# EAGLE design TD3_Filter_dsPIC33EP128GP502 (EAGLE 6.4)
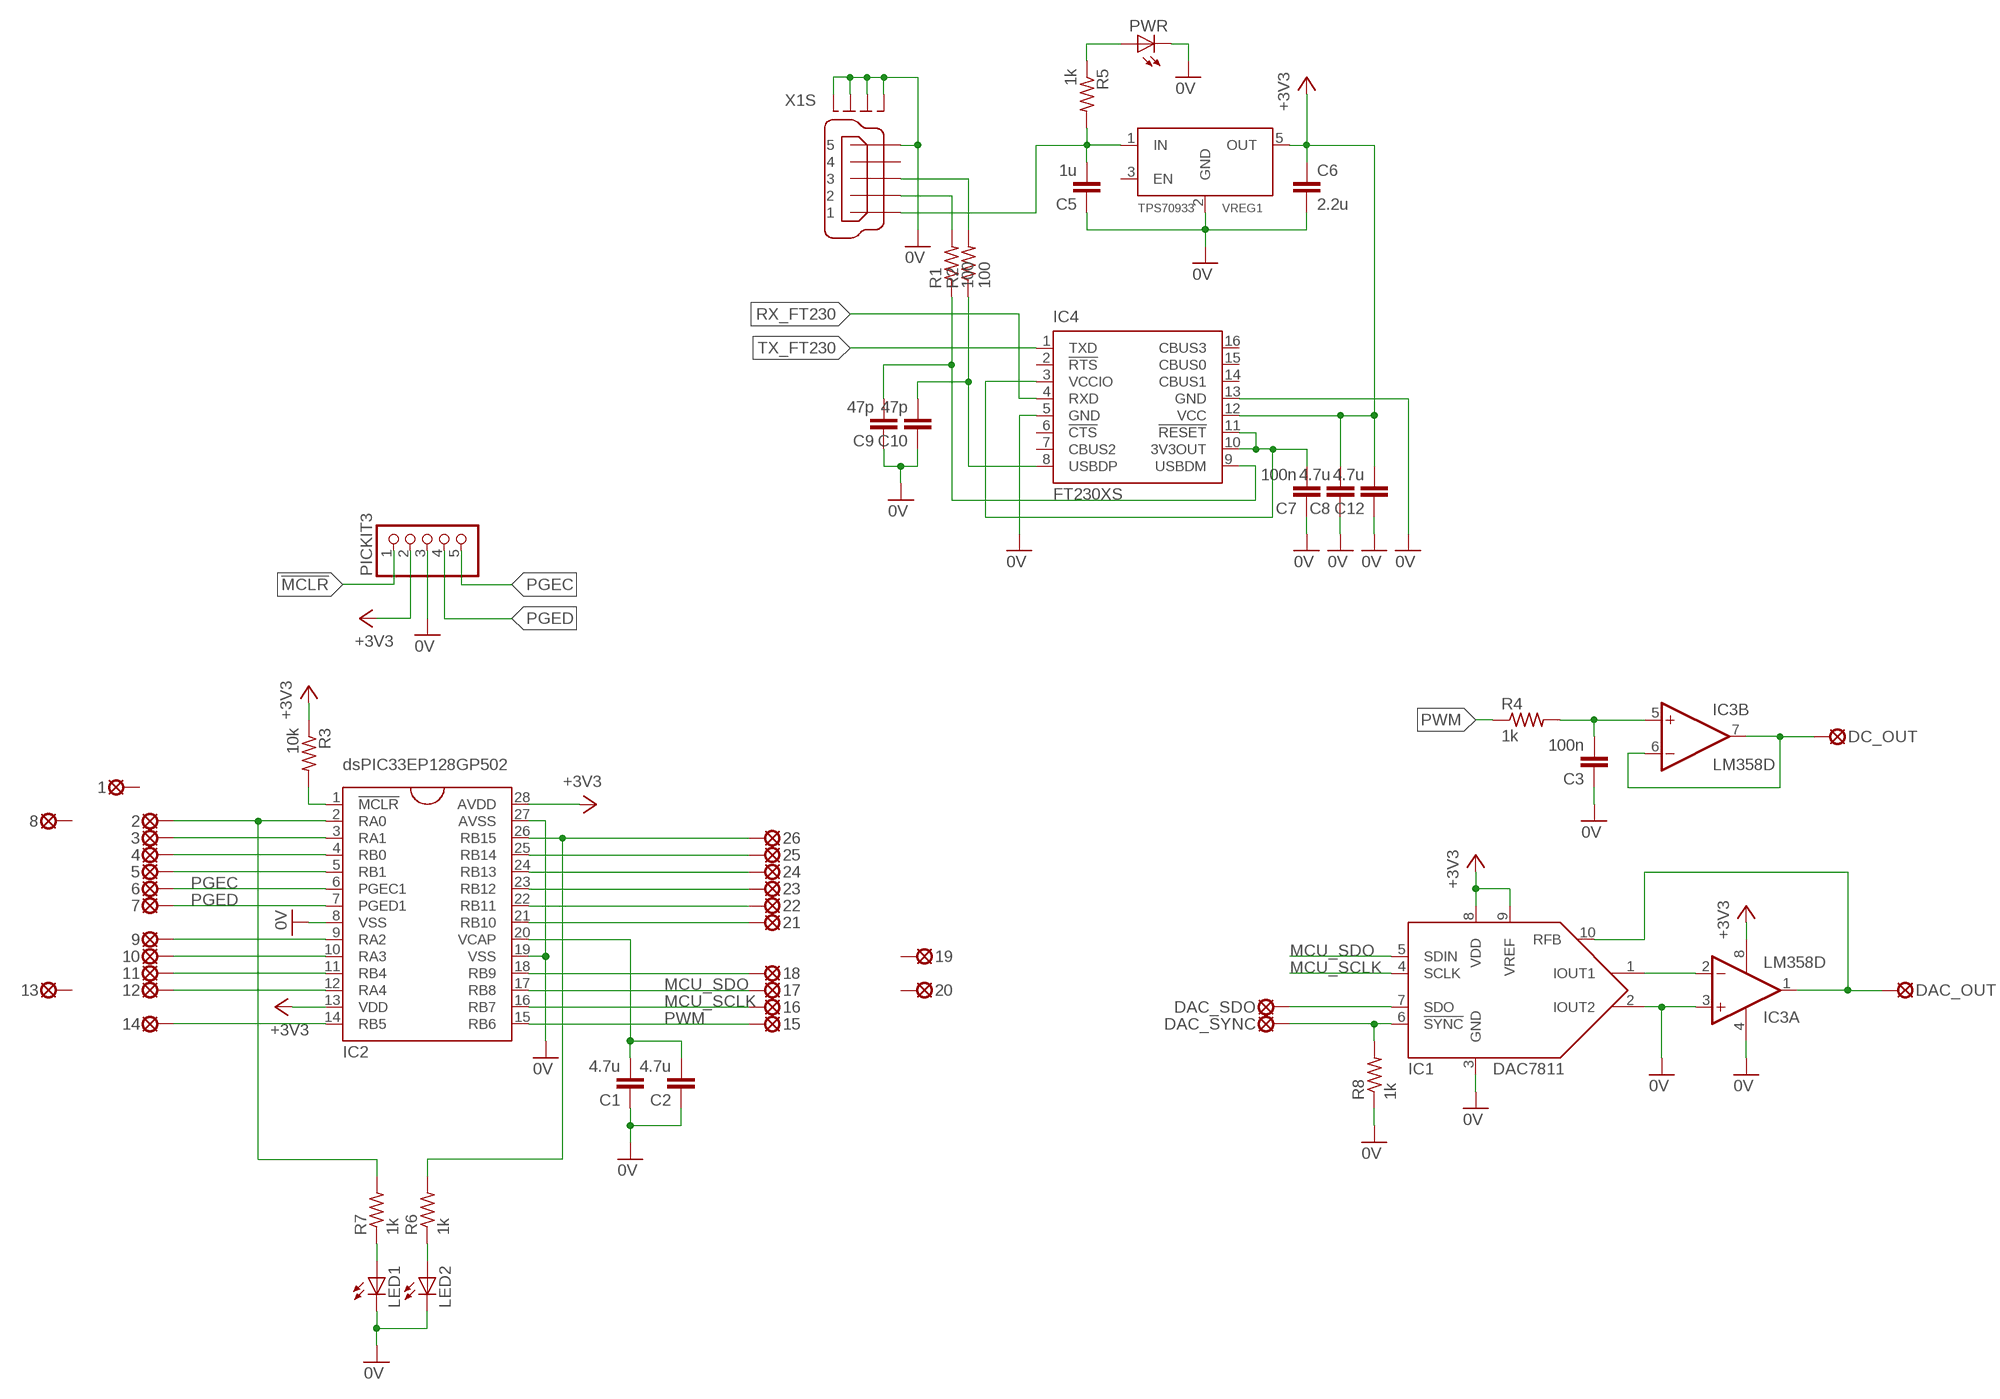
[diagram p0: schematic, sheet 1]

## Parts
1  LSP10  [LSP10]
2  LSP10  [LSP10]
3  LSP10  [LSP10]
4  LSP10  [LSP10]
5  LSP10  [LSP10]
6  LSP10  [LSP10]
7  LSP10  [LSP10]
8  LSP10  [LSP10]
9  LSP10  [LSP10]
10  LSP10  [LSP10]
11  LSP10  [LSP10]
12  LSP10  [LSP10]
13  LSP10  [LSP10]
14  LSP10  [LSP10]
15  LSP10  [LSP10]
16  LSP10  [LSP10]
17  LSP10  [LSP10]
18  LSP10  [LSP10]
19  LSP10  [LSP10]
20  LSP10  [LSP10]
21  LSP10  [LSP10]
22  LSP10  [LSP10]
23  LSP10  [LSP10]
24  LSP10  [LSP10]
25  LSP10  [LSP10]
26  LSP10  [LSP10]
C1  4.7u  C-EUC1206  [C1206]
C2  4.7u  C-EUC1206  [C1206]
C3  100n  C-EUC1206  [C1206]
C5  1u  C-EUC1206  [C1206]
C6  2.2u  C-EUC1206  [C1206]
C7  100n  C-EUC1206  [C1206]
C8  4.7u  C-EUC1206  [C1206]
C9  47p  C-EUC1206  [C1206]
C10  47p  C-EUC1206  [C1206]
C12  4.7u  C-EUC1206  [C1206]
DAC_OUT  LSP10  [LSP10]
DAC_SDO  LSP10  [LSP10]
DAC_SYNC  LSP10  [LSP10]
DC_OUT  LSP10  [LSP10]
IC1  DAC7811  [S-PDSO-G10]
IC2  DSPIC33EP128GP502  [DIL28]
IC3  LM358D  [SO08]
IC4  FT230XS  [SSOP16]
LED1  LED3MM  [LED3MM]
LED2  LED3MM  [LED3MM]
PICKIT3  PINHD-1X5  [1X05]
PWR  LED3MM  [LED3MM]
R1  100  R-US_R0805  [R0805]
R2  100  R-US_R1206  [R1206]
R3  10k  R-US_R0805  [R0805]
R4  1k  R-US_R0805  [R0805]
R5  1k  R-US_R0805  [R0805]
R6  1k  R-US_R0805  [R0805]
R7  1k  R-US_R0805  [R0805]
R8  1k  R-US_R0805  [R0805]
VREG1  TPS70933  [TPS70933]
X1  MINI-USB_SHIELD5P4-32005-400  [32005-400]

## Nets
0V: C1.1 C2.1 C3.1 C5.1 C6.2 C7.1 C8.1 C9.1 C10.1 C12.1 IC1.2(IOUT2) IC1.3(GND) IC2.8(VSS) IC2.19(VSS) IC2.27(AVSS) IC3.3(A:+IN) IC3.4(P:V-) IC4.5(GND) IC4.13(GND) LED1.K(C) LED2.K(C) PICKIT3.3 PWR.K(C) R8.1 VREG1.2(GND) X1.5 X1.M1(S1) X1.M2(S2) X1.M3(S3) X1.M4(S4)
!MCLR!: PICKIT3.1
+3V3: C6.1 C8.2 C12.2 IC1.8(VDD) IC1.9(VREF) IC2.13(VDD) IC2.28(AVDD) IC3.8(P:V+) IC4.12(VCC) PICKIT3.2 R3.1 VREG1.5(OUT)
MCU_SCLK: 16.MP IC1.4(SCLK) IC2.16(RB7)
MCU_SDO: 17.MP IC1.5(SDIN) IC2.17(RB8)
N$1: IC1.1(IOUT1) IC3.2(A:-IN)
N$2: C3.2 IC3.5(B:+IN) R4.2
N$3: PWR.A R5.1
N$4: IC2.1(!MCLR!) R3.2
N$5: DAC_SYNC.MP IC1.6(!SYNC!) R8.2
N$6: C7.2 IC4.3(VCCIO) IC4.10(3V3OUT) IC4.11(!RESET)
N$7: R2.2 X1.3
N$8: C1.2 C2.2 IC2.20(VCAP)
N$9: DAC_SDO.MP IC1.7(SDO)
N$10: C10.2 IC4.8(USBDP) R2.1
N$11: R1.2 X1.2
N$12: C9.2 IC4.9(USBDM) R1.1
N$13: DAC_OUT.MP IC1.10(RFB) IC3.1(A:OUT)
N$15: DC_OUT.MP IC3.6(B:-IN) IC3.7(B:OUT)
N$16: 3.MP IC2.3(RA1)
N$17: 4.MP IC2.4(RB0)
N$18: 5.MP IC2.5(RB1)
N$19: 9.MP IC2.9(RA2)
N$20: 10.MP IC2.10(RA3)
N$21: 11.MP IC2.11(RB4)
N$22: 12.MP IC2.12(RA4)
N$23: 14.MP IC2.14(RB5)
N$24: 22.MP IC2.22(RB11)
N$25: 18.MP IC2.18(RB9)
N$26: 21.MP IC2.21(RB10)
N$27: 23.MP IC2.23(RB12)
N$28: 24.MP IC2.24(RB13)
N$29: 25.MP IC2.25(RB14)
N$31: LED2.A R6.1
N$32: LED1.A R7.1
N$33: 2.MP IC2.2(RA0) R7.2
N$34: C5.2 R5.2 VREG1.1(IN) X1.1
N$35: 26.MP IC2.26(RB15) R6.2
PGEC: 6.MP IC2.6(PGEC1) PICKIT3.5
PGED: 7.MP IC2.7(PGED1) PICKIT3.4
PWM: 15.MP IC2.15(RB6) R4.1
RX_FT230: IC4.4(RXD)
TX_FT230: IC4.1(TXD)
Unconnected: 1.MP 8.MP 13.MP 19.MP 20.MP IC4.2(!RTS) IC4.6(!CTS) IC4.7(CBUS2) IC4.14(CBUS1) IC4.15(CBUS0) IC4.16(CBUS3) VREG1.3(EN) X1.4

## Library data of the parts
1-26 DAC_OUT DAC_SDO DAC_SYNC DC_OUT = solpad:LSP10: SOLDER PAD drill 1.0 mm, distributor Buerklin, 12H555
C1-C3 C5-C10 C12 = rcl:C-EU: CAPACITOR, European symbol
IC1 = DAC7811:DAC7811
IC2 = DSPIC33EP128GP502:DSPIC33EP128GP502
IC3 = linear:LM358: OP AMP also LM158; LM258; LM2904 Source: http://cache.national.com/ds/LM/LM158.pdf
IC4 = ftdichip:FT230X: USB to BASIC UART IC Auto generated by make-symbol-device-package-bsdl.ulp Rev. 43 Source: Data sheet <http://www.ftdichip.com/Support/Documents/DataSheets/ICs/DS_FT230X.pdf>
LED1 LED2 PWR = led:LED: LED OSRAM: - CHIPLED LG R971, LG N971, LY N971, LG Q971, LY Q971, LO R971, LY R971 LH N974, LH R974 LS Q976, LO Q976, LY Q976 LO Q996 - Hyper CHIPLED LW Q18S LB Q993, LB Q99A, LB R99A - SideLED LS A670, LO A670, LY A670, LG A670, LP A670 LB A673, LV A673, LT A673, LW A673 LH A674 LY A675 LS A676, LA A676, LO A676, LY A676, LW A676 LS A679, LY A679, LG A679 - Hyper Micro SIDELED® LS Y876, LA Y876, LO Y876, LY Y876 LT Y87S - SmartLED LW L88C, LW L88S LB L89C, LB L89S, LG L890 LS L89K, LO L89K, LY L89K LS L896, LA L896, LO L896, LY L896 - TOPLED LS T670, LO T670, LY T670, LG T670, LP T670 LSG T670, LSP T670, LSY T670, LOP T670, LYG T670 LG T671, LOG T671, LSG T671 LB T673, LV T673, LT T673, LW T673 LH T674 LS T676, LA T676, LO T676, LY T676, LB T676, LH T676, LSB T676, LW T676 LB T67C, LV T67C, LT T67C, LS T67K, LO T67K, LY T67K, LW E67C LS E67B, LA E67B, LO E67B, LY E67B, LB E67C, LV E67C, LT E67C LW T67C LS T679, LY T679, LG T679 LS T770, LO T770, LY T770, LG T770, LP T770 LB T773, LV T773, LT T773, LW T773 LH T774 LS E675, LA E675, LY E675, LS T675 LS T776, LA T776, LO T776, LY T776, LB T776 LHGB T686 LT T68C, LB T68C - Hyper Mini TOPLED® LB M676 - Mini TOPLED Santana® LG M470 LS M47K, LO M47K, LY M47K Source: http://www.osram.convergy.de LUXEON: - LUMILED® LXK2-PW12-R00, LXK2-PW12-S00, LXK2-PW14-U00, LXK2-PW14-V00 LXK2-PM12-R00, LXK2-PM12-S00, LXK2-PM14-U00 LXK2-PE12-Q00, LXK2-PE12-R00, LXK2-PE12-S00, LXK2-PE14-T00, LXK2-PE14-U00 LXK2-PB12-K00, LXK2-PB12-L00, LXK2-PB12-M00, LXK2-PB14-N00, LXK2-PB14-P00, LXK2-PB14-Q00 LXK2-PR12-L00, LXK2-PR12-M00, LXK2-PR14-Q00, LXK2-PR14-R00 LXK2-PD12-Q00, LXK2-PD12-R00, LXK2-PD12-S00 LXK2-PH12-R00, LXK2-PH12-S00 LXK2-PL12-P00, LXK2-PL12-Q00, LXK2-PL12-R00 Source: www.luxeon.com KINGBRIGHT: KA-3528ASYC Source: www.kingbright.com
PICKIT3 = pinhead:PINHD-1X5: PIN HEADER
R1-R8 = rcl:R-US_: RESISTOR, American symbol
VREG1 = TPS70933:TPS70933
X1 = con-cypressindustries:MINI-USB_SHIELD5P4-: MINI USB-B R/A W/O POST 5 pol. Source: www.cypressindustries.com; OC_FARNELL: unknown; OC_NEWARK: unknown

## Board
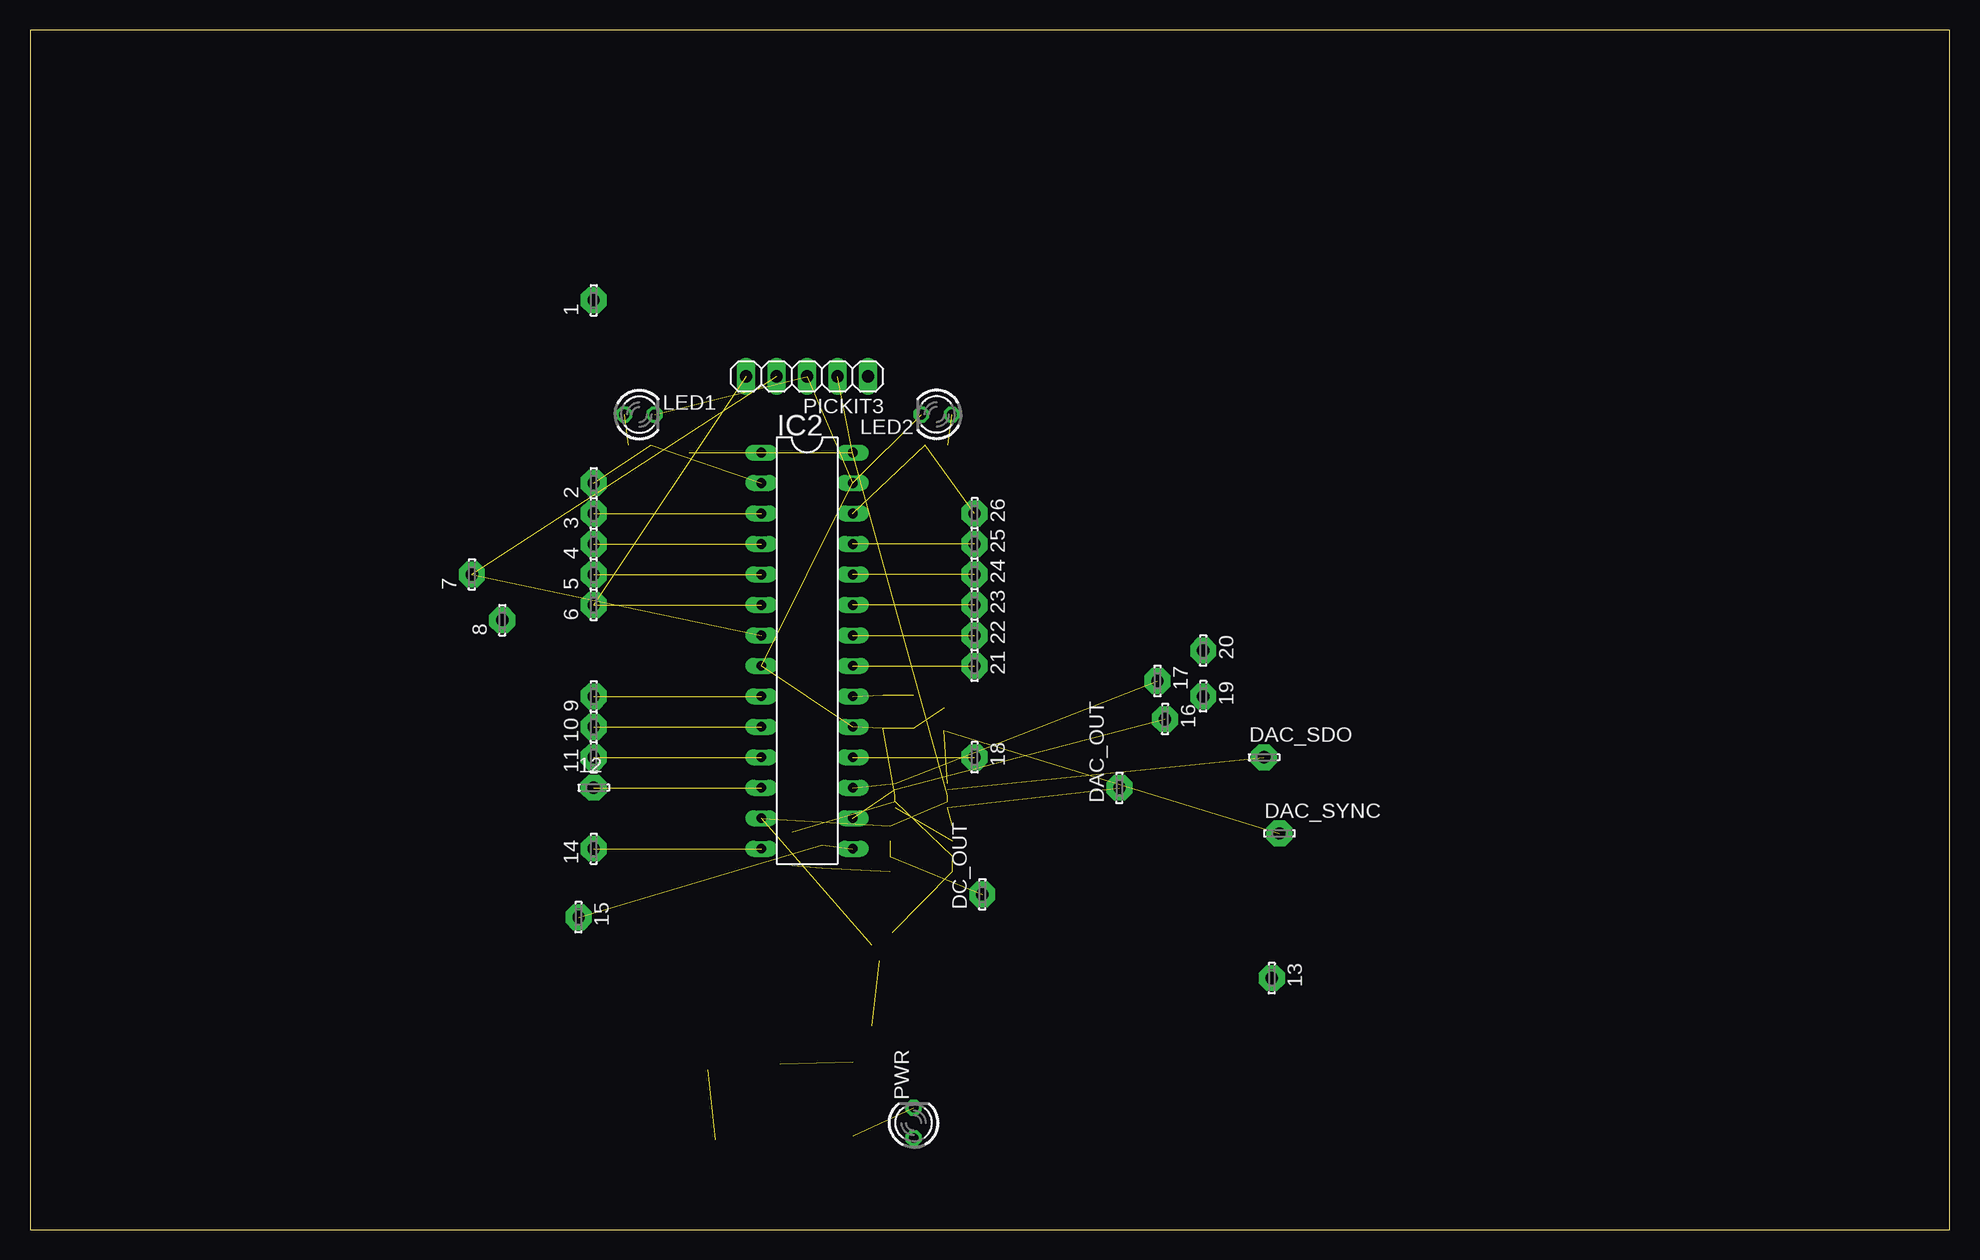
[diagram p1: board, top side]
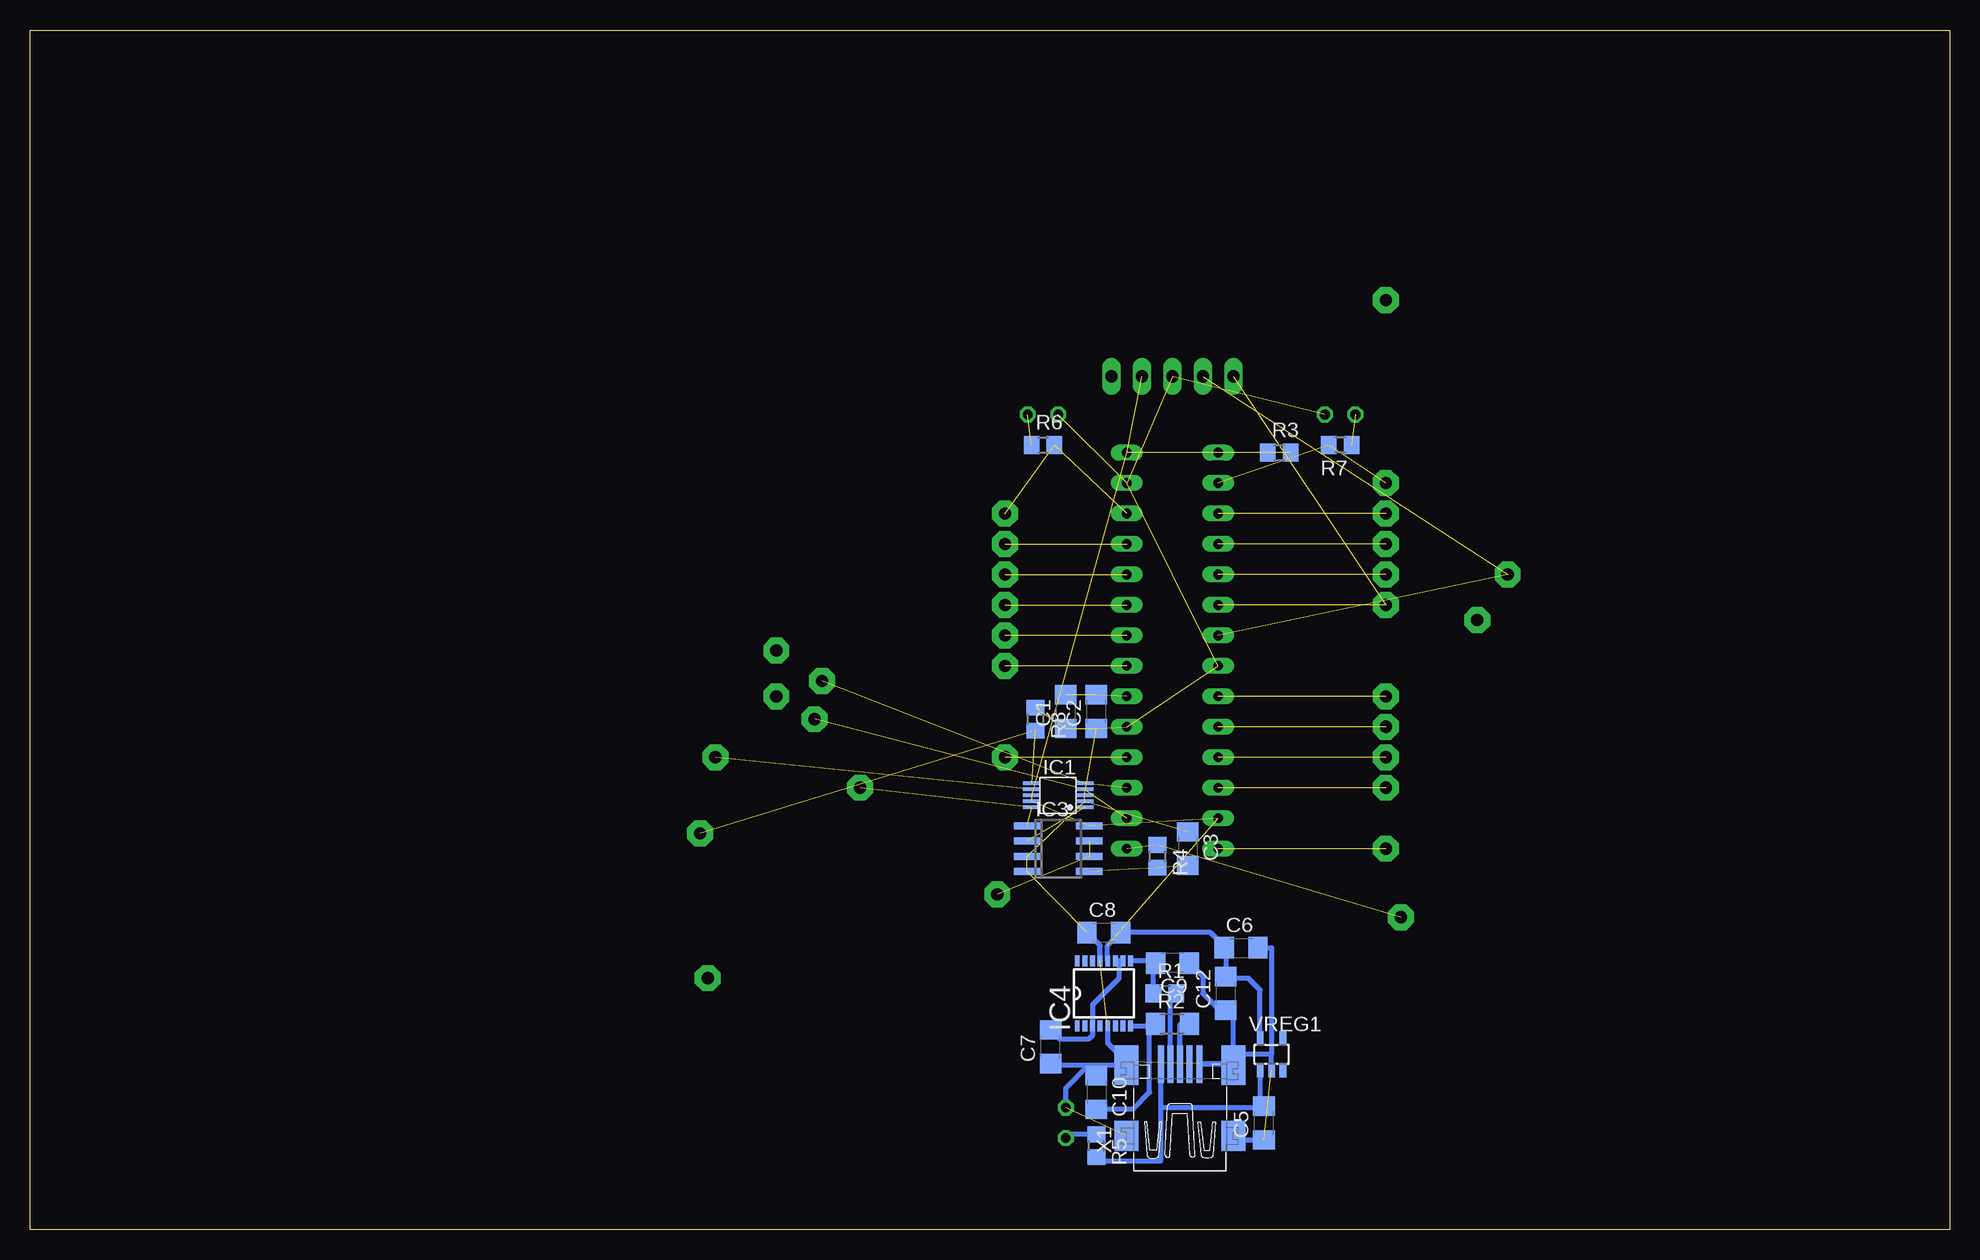
[diagram p2: board, bottom side, seen from below]

Size 160 x 100 mm. Coordinates in mm from the lower left corner, seen from the top.
Outline: 0,0 160,0 160,100 0,100 0,0
Copper layers (1*16): Top 0.035mm / dielectric 1.5mm / Bottom 0.035mm
Design rules "default": minimum track width 10mil, minimum drill 24mil, track to track 8mil, track to pad 8mil, pad to pad 8mil, via to via 8mil, smd to smd 8mil, copper to edge 40mil, drill to drill 8mil, minimum pad ring 10mil, minimum via ring 8mil, stop-mask expansion 4mil, vias tented up to drill 0mil, thermal gap 10mil

### Footprints (pad centres in the part's own frame; a part is rotated, then mirrored left to right if it is on the bottom)
LSP10 = drill 1.016 pad 2.159 octagon: MP 0,0
C1206 = smd 1.6 x 1.8: 1 -1.4,0; 2 1.4,0
S-PDSO-G10 = smd 0.3 x 1.45: 1 -1,-2.2; 2 -0.5,-2.2; 3 0,-2.2; 4 0.5,-2.2; 5 1,-2.2; 6 1,2.2; 7 0.5,2.2; 8 0,2.2; 9 -0.5,2.2; 10 -1,2.2
DIL28 = drill 0.813 long: 1 -16.51,-3.81; 2 -13.97,-3.81; 3 -11.43,-3.81; 4 -8.89,-3.81; 5 -6.35,-3.81; 6 -3.81,-3.81; 7 -1.27,-3.81; 8 1.27,-3.81; 9 3.81,-3.81; 10 6.35,-3.81; 11 8.89,-3.81; 12 11.43,-3.81; 13 13.97,-3.81; 14 16.51,-3.81; 15 16.51,3.81; 16 13.97,3.81; 17 11.43,3.81; 18 8.89,3.81; 19 6.35,3.81; 20 3.81,3.81; 21 1.27,3.81; 22 -1.27,3.81; 23 -3.81,3.81; 24 -6.35,3.81; 25 -8.89,3.81; 26 -11.43,3.81; 27 -13.97,3.81; 28 -16.51,3.81
SO08 = smd 0.6 x 2.2: 1 -1.905,-2.6; 2 -0.635,-2.6; 3 0.635,-2.6; 4 1.905,-2.6; 5 1.905,2.6; 6 0.635,2.6; 7 -0.635,2.6; 8 -1.905,2.6
SSOP16 = smd 0.914 x 0.406: 1 -2.718,2.223; 2 -2.718,1.587; 3 -2.718,0.953; 4 -2.718,0.318; 5 -2.718,-0.318; 6 -2.718,-0.953; 7 -2.718,-1.587; 8 -2.718,-2.223; 9 2.718,-2.223; 10 2.718,-1.587; 11 2.718,-0.953; 12 2.718,-0.318; 13 2.718,0.318; 14 2.718,0.953; 15 2.718,1.587; 16 2.718,2.223
LED3MM = drill 0.813 octagon: A -1.27,0; K 1.27,0
1X05 = drill 1.016 long: 1 -5.08,0; 2 -2.54,0; 3 0,0; 4 2.54,0; 5 5.08,0
R0805 = smd 1.3 x 1.5: 1 -0.95,0; 2 0.95,0
R1206 = smd 1.6 x 1.803: 1 -1.422,0; 2 1.422,0
TPS70933 = smd 0.55 x 1.2: 1 -0.95,-1.3; 2 0,-1.3; 3 0.95,-1.3; 4 0.95,1.3; 5 -0.95,1.3
32005-400 = smd 3.1 x 0.5: 1 3,1.6; 2 3,0.8; 3 3,0; 4 3,-0.8; 5 3,-1.6 | smd 2.5 x 2: M1 -3,-4.45; M2 -3,4.45 | smd 3.3 x 2: M3 2.9,4.45; M4 2.9,-4.45

### Placement (x,y rotation side)
1  46.99,77.47 90 top
2  46.99,62.23 90 top
3  46.99,59.69 90 top
4  46.99,57.15 90 top
5  46.99,54.61 90 top
6  46.99,52.07 90 top
7  36.83,54.61 90 top
8  39.37,50.8 90 top
9  46.99,44.45 90 top
10  46.99,41.91 90 top
11  46.99,39.37 90 top
12  46.99,36.83 0 top
13  103.5,20.95 270 top
14  46.99,31.75 90 top
15  45.72,26.04 270 top
16  94.61,42.55 270 top
17  93.98,45.72 270 top
18  78.74,39.37 270 top
19  97.79,44.45 270 top
20  97.79,48.26 270 top
21  78.74,46.99 270 top
22  78.74,49.53 270 top
23  78.74,52.07 270 top
24  78.74,54.61 270 top
25  78.74,57.15 270 top
26  78.74,59.69 270 top
C1  73.66,43.18 90 bottom
C2  71.12,43.18 90 bottom
C3  63.5,31.75 270 bottom
C5  57.15,8.89 90 bottom
C6  59.05,23.5 0 bottom
C7  74.93,15.24 90 bottom
C8  70.48,24.77 0 bottom
C9  64.77,22.23 180 bottom
C10  71.12,11.43 270 bottom
C12  60.33,19.68 90 bottom
DAC_OUT  90.81,36.83 90 top
DAC_SDO  102.87,39.37 0 top
DAC_SYNC  104.14,33.02 0 top
DC_OUT  79.38,27.94 90 top
IC1  74.3,36.2 90 bottom
IC2  64.77,48.26 270 top
IC3  74.3,31.75 270 bottom
IC4  70.48,19.68 90 bottom
LED1  50.8,67.94 0 top
LED2  75.56,67.94 180 top
PICKIT3  64.77,71.12 180 top
PWR  73.66,8.89 90 top
R1  65.41,19.68 0 bottom
R2  64.77,17.14 0 bottom
R3  55.88,64.77 0 bottom
R4  66.04,31.11 270 bottom
R5  71.12,6.99 270 bottom
R6  75.56,65.41 0 bottom
R7  50.8,65.41 180 bottom
R8  76.2,42.55 270 bottom
VREG1  56.52,14.61 0 bottom
X1  64.14,10.79 90 bottom

### Tracks (layer width: path | path; a pad name or v marks a point on that pad's centre or on a via)
0V  (18 unrouted)
  Bottom 0.406: IC4.5 70.17,15.56 68.58,13.97 X1.M3 71.12,13.7 | IC4.13 70.8,23.68 C8.1 | X1.M4 59.78,13.79 X1.5 59.69,13.79 59.69,14.61 | 71.12,13.7 71.75,13.7 | 71.75,13.7 74.78,13.7 C7.1 | C10.1 71.12,13.7 | PWR.K 73.66,11.79 71.75,13.7 | X1.M1 59.38,7.49 C5.1 | C9.1 62.23,21.09 62.23,19.68 60.83,18.29 C12.1 59.69,17.65 59.69,14.61 | VREG1.2 56.52,14.61 | 56.52,14.61 59.69,14.61 | C6.2 56.52,23.5 56.52,14.61
+3V3  (7 unrouted)
  Bottom 0.406: 60.33,23.5 61.59,24.77 C8.2 70.17,23.68 IC4.12 | C6.1 60.33,23.5 | 60.33,23.5 C12.2 60.2,20.95 58.42,20.95 57.47,20 VREG1.5
MCU_SCLK  (2 unrouted)
MCU_SDO  (2 unrouted)
N$1  (1 unrouted)
N$2  (2 unrouted)
N$3
  Bottom 0.406: R5.1 73.34,7.93 PWR.A
N$4  (1 unrouted)
N$5  (2 unrouted)
N$6
  Bottom 0.406: IC4.10 IC4.11 69.22,22.09 69.22,20.95 71.44,18.73 IC4.3 71.44,16.19 71.75,15.88 74.17,15.88 C7.2
N$7
  Bottom 0.406: X1.3 64.14,17.14 R2.2
N$8  (2 unrouted)
N$9  (1 unrouted)
N$10
  Bottom 0.406: IC4.8 66.37,16.97 R2.1 66.67,17.14 66.67,11.43 68.08,10.03 C10.2
N$11
  Bottom 0.406: X1.2 64.94,19.68 R1.2
N$12
  Bottom 0.406: IC4.9 66.17,22.4 C9.2 66.36,22.23 R1.1
N$13  (2 unrouted)
N$15  (2 unrouted)
N$16  (1 unrouted)
N$17  (1 unrouted)
N$18  (1 unrouted)
N$19  (1 unrouted)
N$20  (1 unrouted)
N$21  (1 unrouted)
N$22  (1 unrouted)
N$23  (1 unrouted)
N$24  (1 unrouted)
N$25  (1 unrouted)
N$26  (1 unrouted)
N$27  (1 unrouted)
N$28  (1 unrouted)
N$29  (1 unrouted)
N$31  (1 unrouted)
N$32  (1 unrouted)
N$33  (2 unrouted)
N$34
  Bottom 0.406: 65.73,10.16 57.15,10.16 C5.2 57.47,10.61 VREG1.1 | 65.73,10.16 X1.1 | R5.2 71.12,5.71 65.73,5.71 65.73,10.16
N$35  (2 unrouted)
PGEC  (2 unrouted)
PGED  (2 unrouted)
PWM  (2 unrouted)